# EAGLE design PowerKitPTH (EAGLE 6.6.0)
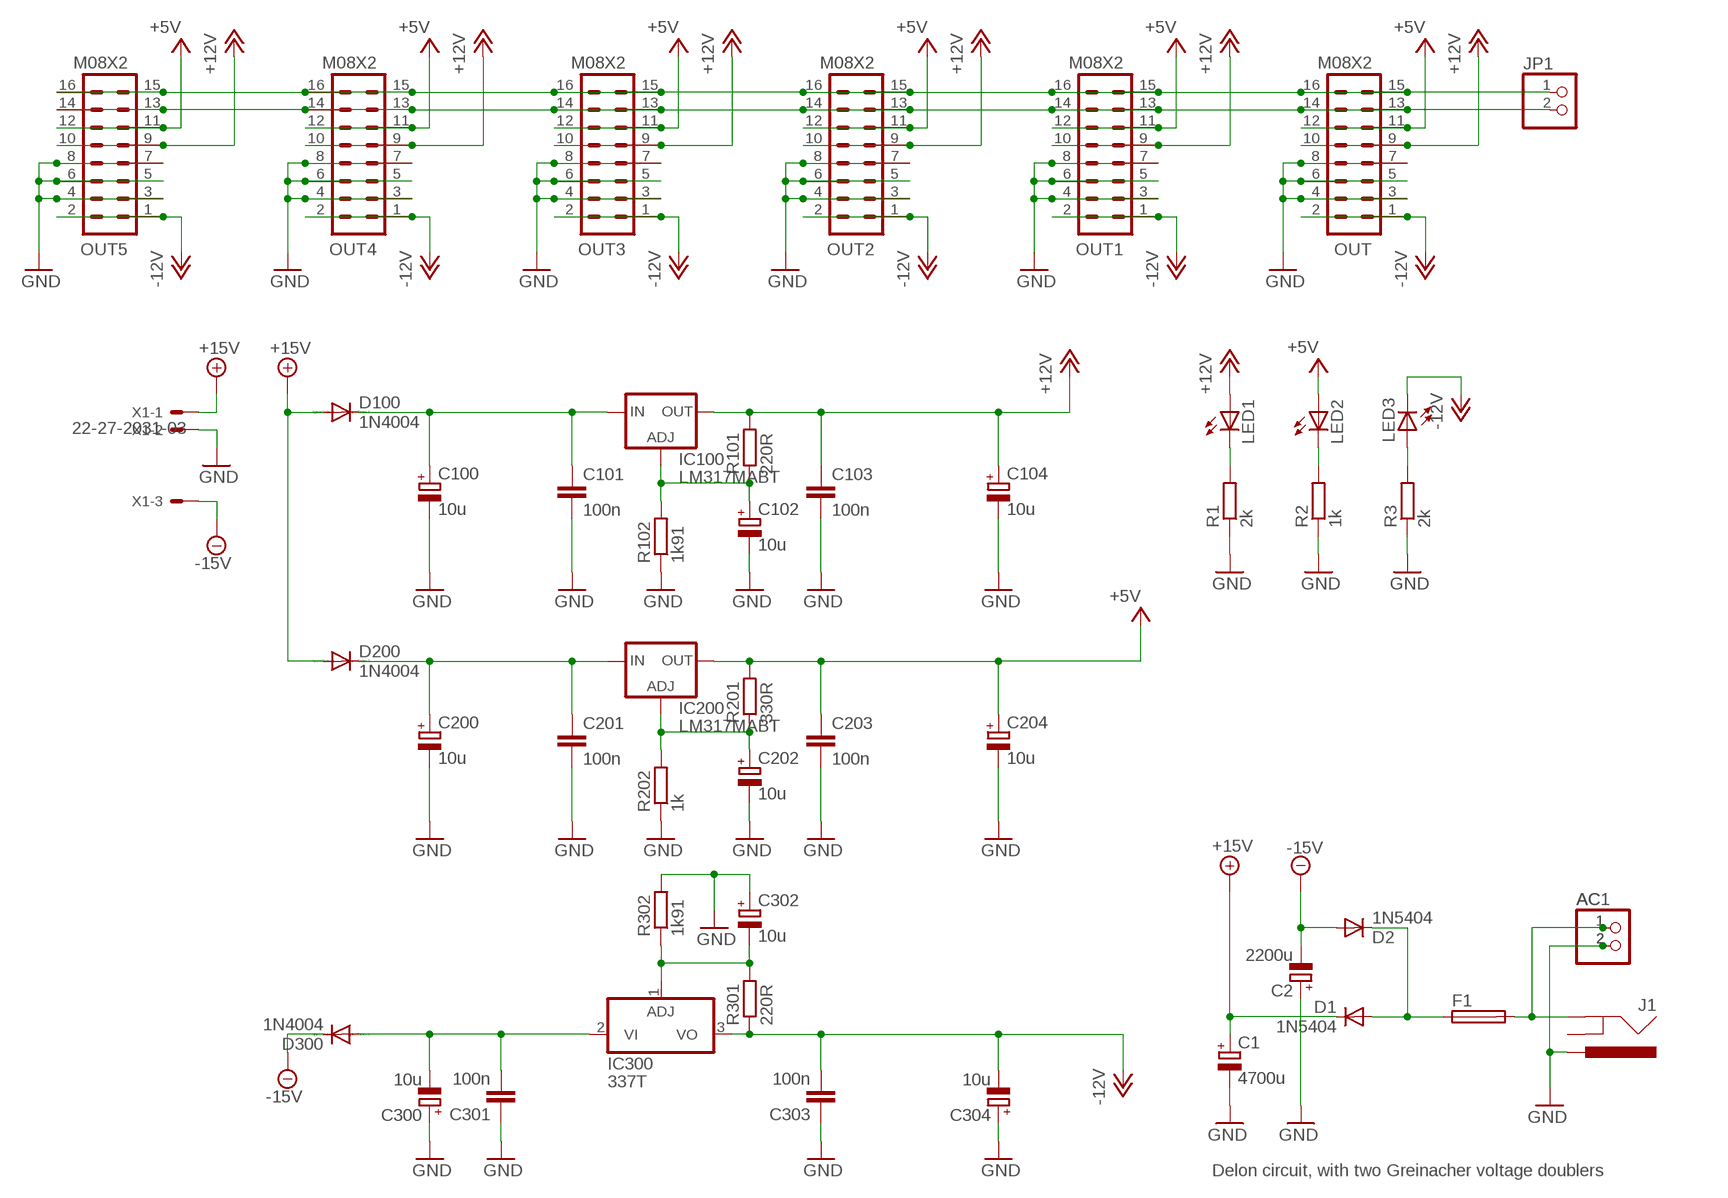
[diagram p0: schematic, sheet 1]

## Parts
AC  PINHD-1X2  [1X02]
AC1  PINHD-1X2  [1X02]
C1  4700u  CPOL-EUE7.5-18  [E7,5-18]
C2  2200u  CPOL-EUE7.5-18  [E7,5-18]
C100  10u  CPOL-EUE2.5-6  [E2,5-6]
C101  100n  C-EU050-025X075  [C050-025X075]
C102  10u  CPOL-EUE2.5-6  [E2,5-6]
C103  100n  C-EU050-025X075  [C050-025X075]
C104  10u  CPOL-EUE2.5-6  [E2,5-6]
C200  10u  CPOL-EUE2.5-6  [E2,5-6]
C201  100n  C-EU050-025X075  [C050-025X075]
C202  10u  CPOL-EUE2.5-6  [E2,5-6]
C203  100n  C-EU050-025X075  [C050-025X075]
C204  10u  CPOL-EUE2.5-6  [E2,5-6]
C300  10u  CPOL-EUE2.5-6  [E2,5-6]
C301  100n  C-EU050-025X075  [C050-025X075]
C302  10u  CPOL-EUE2.5-6  [E2,5-6]
C303  100n  C-EU050-025X075  [C050-025X075]
C304  10u  CPOL-EUE2.5-6  [E2,5-6]
D1  1N5404  DIODE1N4001  [DIODE-1N4001]
D2  1N5404  DIODE1N4001  [DIODE-1N4001]
D100  1N4004  [DO41-10]
D200  1N4004  [DO41-10]
D300  1N4004  [DO41-10]
F1  SH22,5  [SH22,5]
IC100  LM317MABT  [TO220L1]
IC200  LM317MABT  [TO220L1]
IC300  337T  [TO220H]
J1  POWER_JACKPTH  [POWER_JACK_PTH]
JP1  PINHD-1X2  [1X02]
LED1  LED3MM  [LED3MM]
LED2  LED3MM  [LED3MM]
LED3  LED3MM  [LED3MM]
OUT  M08X2  [2X8]
OUT1  M08X2  [2X8]
OUT2  M08X2  [2X8]
OUT3  M08X2  [2X8]
OUT4  M08X2  [2X8]
OUT5  M08X2  [2X8]
R1  2k  R-EU_0204/7  [0204/7]
R2  1k  R-EU_0204/7  [0204/7]
R3  2k  R-EU_0204/7  [0204/7]
R101  220R  R-EU_0204/7  [0204/7]
R102  1k91  R-EU_0204/7  [0204/7]
R201  330R  R-EU_0204/7  [0204/7]
R202  1k  R-EU_0204/7  [0204/7]
R301  220R  R-EU_0204/7  [0204/7]
R302  1k91  R-EU_0204/7  [0204/7]
X1  22-27-2031-03  [6410-03]

## Nets
+5V: C203.1 C204.+ IC200.2(OUT) LED2.A OUT1.11 OUT1.12 OUT2.11 OUT2.12 OUT3.11 OUT3.12 OUT4.11 OUT4.12 OUT5.11 OUT5.12 OUT.11 OUT.12 R201.2
+12V: C103.1 C104.+ IC100.2(OUT) LED1.A OUT1.9 OUT1.10 OUT2.9 OUT2.10 OUT3.9 OUT3.10 OUT4.9 OUT4.10 OUT5.9 OUT5.10 OUT.9 OUT.10 R101.2
+15V: C1.+ D1.C D100.A D200.A X1.1
-12V: C303.2 C304.- IC300.3(VO) LED3.K(C) OUT1.1 OUT1.2 OUT2.1 OUT2.2 OUT3.1 OUT3.2 OUT4.1 OUT4.2 OUT5.1 OUT5.2 OUT.1 OUT.2 R301.1
-15V: C2.- D2.A D300.C X1.3
GND: AC1.2 AC.2 C1.- C2.+ C100.- C101.2 C102.- C103.2 C104.- C200.- C201.2 C202.- C203.2 C204.- C300.+ C301.1 C302.+ C303.1 C304.+ J1.PWR OUT1.3 OUT1.4 OUT1.5 OUT1.6 OUT1.7 OUT1.8 OUT2.3 OUT2.4 OUT2.5 OUT2.6 OUT2.7 OUT2.8 OUT3.3 OUT3.4 OUT3.5 OUT3.6 OUT3.7 OUT3.8 OUT4.3 OUT4.4 OUT4.5 OUT4.6 OUT4.7 OUT4.8 OUT5.3 OUT5.4 OUT5.5 OUT5.6 OUT5.7 OUT5.8 OUT.3 OUT.4 OUT.5 OUT.6 OUT.7 OUT.8 R1.1 R2.1 R3.1 R102.1 R202.1 R302.2 X1.2
N$1: LED2.K(C) R2.2
N$2: LED1.K(C) R1.2
N$3: C102.+ IC100.1(ADJ) R101.1 R102.2
N$4: C202.+ IC200.1(ADJ) R201.1 R202.2
N$5: C302.- IC300.1(ADJ) R301.2 R302.1
N$6: C300.- C301.2 D300.A IC300.2(VI)
N$7: C200.+ C201.1 D200.C IC200.3(IN)
N$8: C100.+ C101.1 D100.C IC100.3(IN)
N$9: LED3.A R3.2
N$10: JP1.2 OUT1.13 OUT1.14 OUT2.13 OUT2.14 OUT3.13 OUT3.14 OUT4.13 OUT4.14 OUT5.13 OUT5.14 OUT.13 OUT.14
N$11: D1.A D2.C F1.1
N$12: JP1.1 OUT1.15 OUT1.16 OUT2.15 OUT2.16 OUT3.15 OUT3.16 OUT4.15 OUT4.16 OUT5.15 OUT5.16 OUT.15 OUT.16
N$13: AC1.1 AC.1 F1.2 J1.GND
Unconnected: J1.GNDBREAK

## Notes on the sheet
- Delon circuit, with two Greinacher voltage doublers

## Library data of the parts
AC AC1 JP1 = pinhead:PINHD-1X2: PIN HEADER
C1 C2 = resistor:CPOL-EU: POLARIZED CAPACITOR, European symbol
C100 C102 C104 C200 C202 C204 C300 C302 C304 = rcl:CPOL-EU: POLARIZED CAPACITOR, European symbol
C101 C103 C201 C203 C301 C303 = resistor:C-EU: CAPACITOR, European symbol
D1 D2 = Rebel:DIODE: Diode These are standard reverse protection diodes and small signal diodes. SMA package can handle up to about 1A. SOD-323 can handle about 200mA. Watch the SOD-323 package when ordering, there are some mfgs out there that are 5-pin packages.
D100 D200 D300 = diode:1N4004: DIODE general purpose rectifier, 1 A
F1 = fuse:SH22,5: FUSE HOLDER grid 22,5 mm, OGN0031 8201, Schurter (Buerklin); MF: SCHURTER; MPN: 0031.8201; OC_FARNELL: 1162740; OC_NEWARK: 96F8317
IC100 IC200 = v-reg:LM317?*: 500 mA Adjustable Output Positive Voltage Regulator Source: http://www.onsemi.co.jp .. LM317M-D.PDF
IC300 = linear:*337: Negative VOLTAGE REGULATOR
J1 = SparkFun:POWER_JACK: Power Jack This is the standard 5.5mm barrel jack for power. The PTH is the most common, proven, reliable, footprint. All others are experimental. The Slot footprint only works if the mill layer is transmitted to the PCB fab house so be warned. Spark Fun Electronics SKU : PRT-00119. Mating wall wart : TOL-00298 (and others)
LED1-LED3 = Rebel:LED: LED
OUT OUT1-OUT5 = SparkFun:M08X2
R1-R3 R101 R102 R201 R202 R301 R302 = resistor:R-EU_: RESISTOR, European symbol
X1 = con-molex:22-?-03: CONNECTOR wire to board 2.54 mm (.1 inch) pitch header; OC_FARNELL: unknown; OC_NEWARK: unknown

## Board
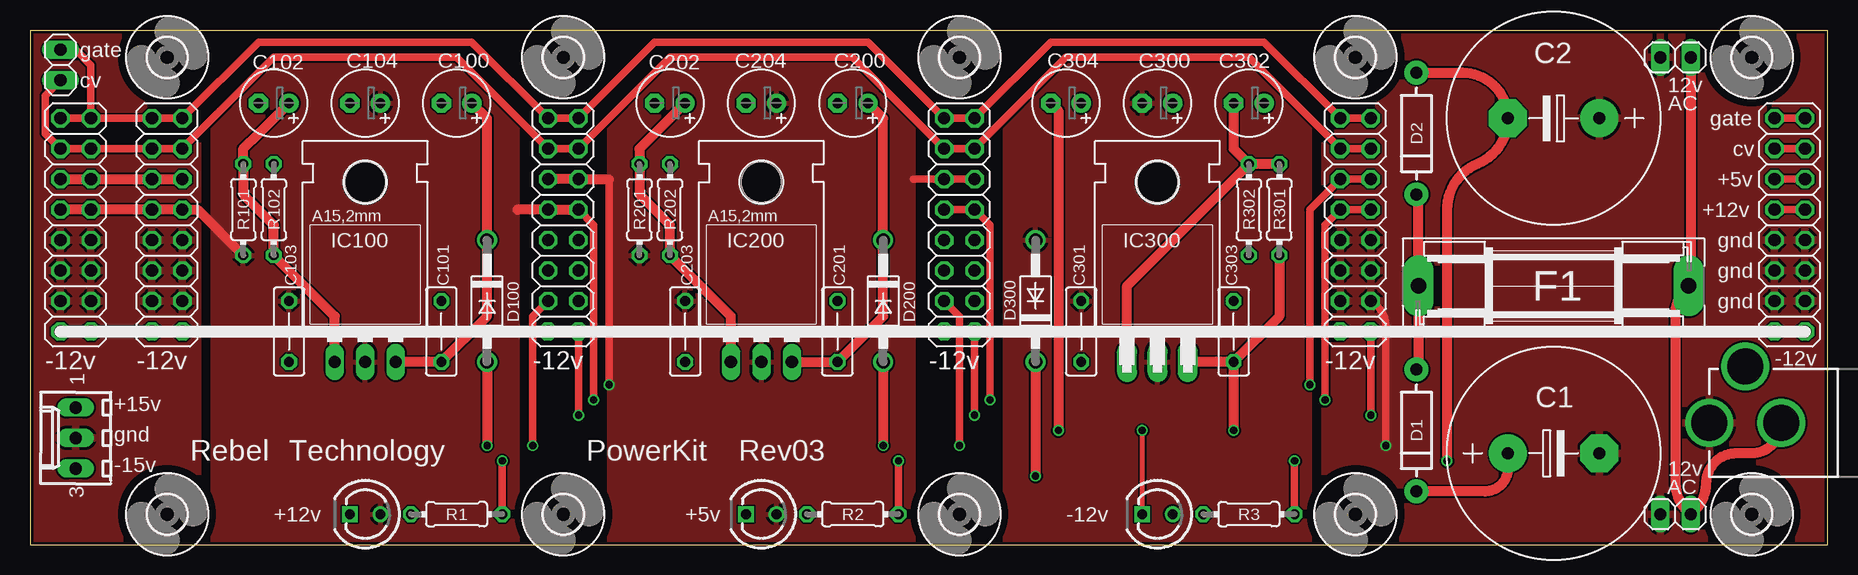
[diagram p1: board, top side]
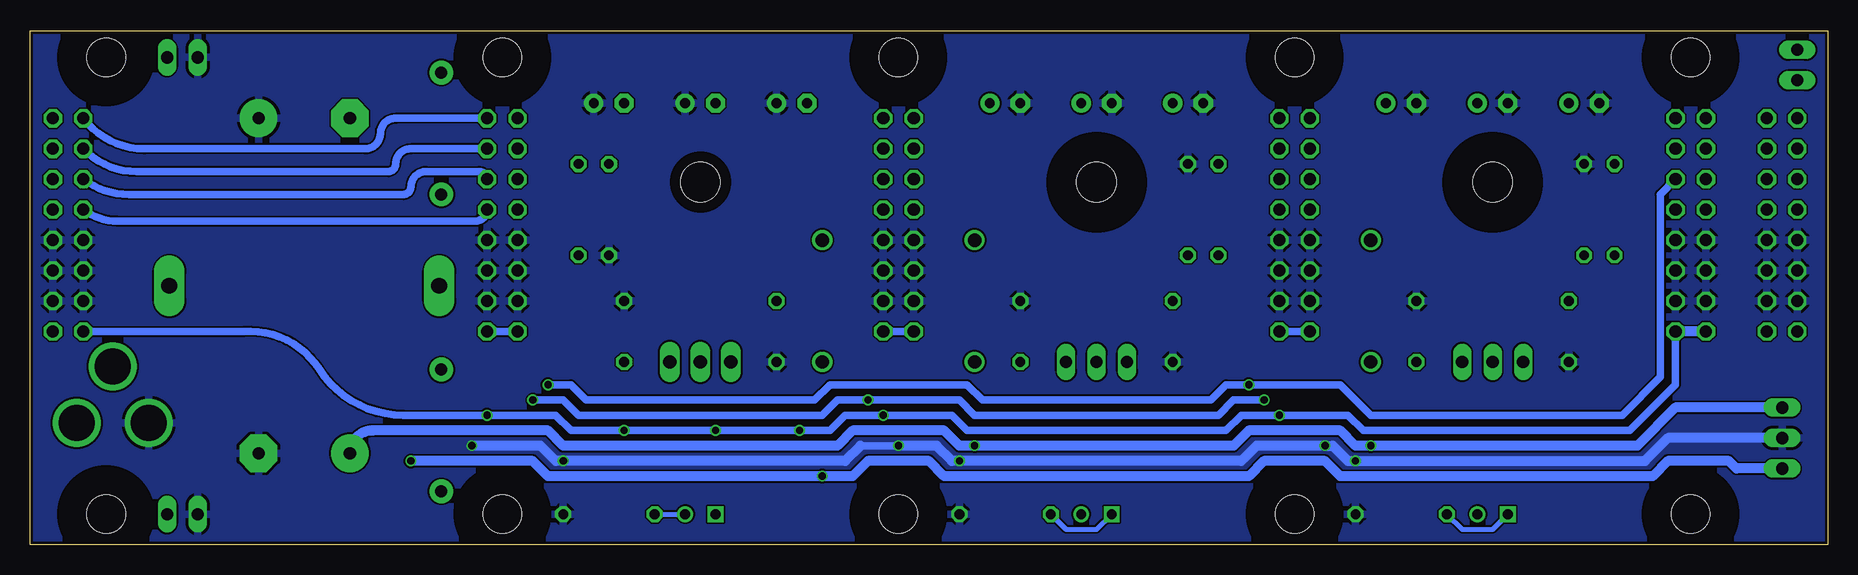
[diagram p2: board, bottom side, seen from below]

Size 149.86 x 42.85 mm. Coordinates in mm from the lower left corner, seen from the top.
Outline: 0,0 149.86,0 149.86,42.85 0,42.85 0,0
Copper layers (1*16): Top 0.035mm / dielectric 1.5mm / Bottom 0.035mm
Design rules "Fusion_eagle_rule_v1.1": minimum track width 6mil, minimum drill 12mil, track to track 6mil, track to pad 6mil, pad to pad 6mil, via to via 6mil, smd to smd 0mil, copper to edge 10mil, drill to drill 10mil, minimum pad ring 10mil, minimum via ring 6mil, stop-mask expansion 2mil, vias tented up to drill 100mil, thermal gap 10mil

### Footprints (pad centres in the part's own frame; a part is rotated, then mirrored left to right if it is on the bottom)
1X02 = drill 1.016 long: 1 -1.27,0; 2 1.27,0
E7,5-18 = drill 1.016 pad 3.15: + -3.81,0 | drill 1.016 pad 3.15 octagon: - 3.81,0
E2,5-6 = drill 0.813 pad 1.6: + -1.27,0 | drill 0.813 pad 1.6 octagon: - 1.27,0
C050-025X075 = drill 0.813 octagon: 1 -2.54,0; 2 2.54,0
DIODE-1N4001 = drill 1 pad 1.981: A -5.08,0; C 5.08,0
DO41-10 = drill 1.118: A 5.08,0; C -5.08,0
SH22,5 = drill 1.321 pad 2.54 long: 1 -11.252,0; 2 11.252,0
TO220L1 = drill 1.016 long: 1 -2.54,-3.81; 2 0,-3.81; 3 2.54,-3.81 | hole 3.302: 0,11.176
TO220H = drill 1.118 long: 1 -2.54,-10.16; 2 0,-10.16; 3 2.54,-10.16 | hole 3.302: 0,4.826
POWER_JACK_PTH = drill 2.997: GND 0,7.7; GNDBREAK 4.7,10.7; PWR 0,13.7
LED3MM = drill 0.813: A -1.27,0 | drill 0.813 square: K 1.27,0
2X8 = drill 1.016 octagon: 1 0,0; 2 0,2.54; 3 2.54,0; 4 2.54,2.54; 5 5.08,0; 6 5.08,2.54; 7 7.62,0; 8 7.62,2.54; 9 10.16,0; 10 10.16,2.54; 11 12.7,0; 12 12.7,2.54; 13 15.24,0; 14 15.24,2.54; 15 17.78,0; 16 17.78,2.54
0204/7 = drill 0.813 octagon: 1 -3.81,0; 2 3.81,0
3,2 = hole 3.2: 0,0
6410-03 = drill 1.016 long: 1 2.54,0; 2 0,0; 3 -2.54,0

### Placement (x,y rotation side)
AC  137.16,2.54 180 top
AC1  137.16,40.64 180 top
C1  127,7.62 0 top
C2  127,35.56 180 top
C100  35.56,36.83 180 top
C101  34.29,17.78 90 top
C102  20.32,36.83 180 top
C103  21.59,17.78 270 top
C104  27.94,36.83 180 top
C200  68.58,36.83 180 top
C201  67.31,17.78 90 top
C202  53.34,36.83 180 top
C203  54.61,17.78 270 top
C204  60.96,36.83 180 top
C300  93.98,36.83 180 top
C301  87.63,17.78 90 top
C302  101.6,36.83 180 top
C303  100.33,17.78 270 top
C304  86.36,36.83 180 top
D1  115.57,9.53 270 top
D2  115.57,34.29 270 top
D100  38.1,20.32 270 top
D200  71.12,20.32 270 top
D300  83.82,20.32 90 top
F1  127,21.59 0 top
IC100  27.94,19.05 0 top
IC200  60.96,19.05 0 top
IC300  93.98,25.4 0 top
J1  153.67,10.16 90 top
JP1  2.54,40.01 270 top
LED1  27.94,2.54 180 top
LED2  60.96,2.54 180 top
LED3  93.98,2.54 180 top
OUT  12.7,17.78 90 top
OUT1  45.72,17.78 90 top
OUT2  78.74,17.78 90 top
OUT3  111.76,17.78 90 top
OUT4  147.96,17.78 90 top
OUT5  5.08,17.78 90 top
R1  35.56,2.54 180 top
R2  68.58,2.54 180 top
R3  101.6,2.54 180 top
R101  17.78,27.94 270 top
R102  20.32,27.94 270 top
R201  50.8,27.94 270 top
R202  53.34,27.94 270 top
R301  104.14,27.94 90 top
R302  101.6,27.94 270 top
U$1  [3,2]  44.45,2.54 0 top
U$2  [3,2]  110.49,2.54 0 top
U$3  [3,2]  44.45,40.64 0 top
U$4  [3,2]  110.49,40.64 0 top
U$5  [3,2]  11.43,40.64 0 top
U$6  [3,2]  11.43,2.54 0 top
U$7  [3,2]  77.47,40.64 0 top
U$8  [3,2]  77.47,2.54 0 top
U$12  [3,2]  143.51,40.64 0 top
U$13  [3,2]  143.51,2.54 0 top
X1  3.81,8.89 90 top

### Tracks (layer width: path | path; a pad name or v marks a point on that pad's centre or on a via)
+5V  (via drill 0.6)
  Top 0.61: 48.26,30.48 v48.26,13.34 | 73.66,30.48 OUT2.12 OUT2.11 | OUT4.11 OUT4.12 | v106.68,13.34 106.68,27.94 OUT3.12 OUT3.11
  Top 0.813: 48.26,30.48 OUT1.11 OUT1.12 | OUT5.12 OUT5.11 OUT.12 OUT.11
  Bottom 0.61: OUT.11 13.97,29.21 13.97,13.97 17.14,10.79 38.1,10.79 40.64,13.34 v48.26,13.34 50.16,13.34 51.44,12.06 70.48,12.06 71.75,13.34 83.19,13.34 84.45,12.06 103.5,12.06 104.78,13.34 v106.68,13.34 | OUT3.11 arc-90 112.39,31.11 116.84,31.11 arc-90 118.11,29.84 arc90 118.75,29.21 141.6,29.21 arc37 OUT4.12
  pour Top: 48.26,44.45 48.26,0 73.66,0 73.66,44.45
+12V  (via drill 0.6)
  Top 0.61: OUT1.9 46.99,26.67 v46.99,12.06 | v80.01,12.06 80.01,26.67 OUT2.9 OUT2.10 | v107.95,12.06 107.95,26.67 OUT3.10 OUT3.9 | OUT4.9 OUT4.10
  Top 0.813: 40.64,27.94 OUT1.10 OUT1.9 | OUT5.10 OUT5.9 OUT.10 OUT.9 13.97,27.94 R101.2
  Bottom 0.61: v46.99,12.06 49.53,12.06 50.8,10.79 71.12,10.79 72.39,12.06 v80.01,12.06 82.55,12.06 83.82,10.79 104.14,10.79 105.41,12.06 v107.95,12.06 | OUT4.10 arc-37 142.56,26.99 112.71,26.99 arc-90 OUT3.9
  pour Top: 15.24,44.45 15.24,0 40.64,0 40.64,44.45
+15V  (via drill 0.6)
  Top 0.813: D100.A v38.1,8.26 | D200.A v71.12,8.26 | C1.+ 123.19,6.35 arc-90 121.28,4.45 D1.C
  Bottom 0.813: X1.1 12.7,11.43 15.88,8.26 v38.1,8.26 39.37,8.26 40.64,9.53 48.26,9.53 49.53,8.26 v71.12,8.26 72.39,8.26 73.66,9.53 81.28,9.53 82.55,8.26 105.41,8.26 106.68,9.53 121.28,9.53 arc-90 C1.+
-12V  (via drill 0.6)
  Top 0.406: LED3.K v92.71,9.53
  Top 0.61: OUT1.1 v45.72,10.79 | OUT2.1 v78.74,10.79 | OUT3.1 v111.76,10.79 | OUT4.1 OUT4.2
  Top 0.813: OUT.2 OUT5.1 OUT5.2 | C303.2 v100.33,9.53 | C303.2 IC300.3 | R301.1 104.14,19.05 C303.2 | C304.- 85.72,36.2 v85.72,9.53
  Bottom 0.61: OUT.1 12.7,13.34 16.51,9.53 38.73,9.53 40.01,10.79 v45.72,10.79 48.9,10.79 50.16,9.53 71.75,9.53 73.03,10.79 v78.74,10.79 81.92,10.79 83.19,9.53 v85.72,9.53 v92.71,9.53 v100.33,9.53 104.78,9.53 106.05,10.79 v111.76,10.79 118.75,10.79 arc57 125.73,14.61 arc-61 132.08,17.78 OUT4.2 | OUT2.1 OUT2.2 | OUT1.1 OUT1.2 | OUT3.1 OUT3.2
  Bottom 0.813: OUT.2 OUT.1
-15V  (via drill 0.6)
  Top 0.813: D300.C v83.82,5.71 | D2.A 119.38,39.37 arc-90 C2.- arc-67 120.65,31.75 arc67 118.11,27.94 v118.11,6.99
  Bottom 0.813: X1.3 7.62,6.35 8.26,6.99 13.34,6.99 14.61,5.71 40.64,5.71 41.91,6.99 46.99,6.99 48.26,5.71 73.66,5.71 74.93,6.99 80.01,6.99 81.28,5.71 v83.82,5.71 106.68,5.71 107.95,6.99 v118.11,6.99
GND  (via drill 0.6)
  Top 0.61: OUT2.4 77.47,19.05 v77.47,8.26 | OUT1.4 41.91,19.05 v41.91,8.26 | v113.03,8.26 113.03,18.41 arc53 OUT3.3 | R1.1 v39.37,6.99 | R2.1 v72.39,6.99 | R3.1 v105.41,6.99
  Bottom 0.61: v77.47,8.26 80.64,8.26
  Bottom 0.813: X1.2 13.34,8.89 15.24,6.99 v39.37,6.99 40.01,6.99 41.27,8.26 v41.91,8.26 47.62,8.26 48.9,6.99 v72.39,6.99 73.03,6.99 74.3,8.26 v77.47,8.26 | 80.64,8.26 81.92,6.99 v105.41,6.99 106.05,6.99 107.31,8.26 v113.03,8.26
  pour Bottom: 0,10.79 0,0 114.3,0 114.3,10.79
  pour Bottom: 0,44.45 0,0 13.97,0 13.97,44.45
  pour Bottom: 13.97,44.45 13.97,0 151.13,0 151.13,44.45
  pour Bottom: 74.93,26.67 80.01,26.67 80.01,19.05 74.93,19.05
  pour Bottom: 41.91,26.67 46.99,26.67 46.99,19.05 41.91,19.05
  pour Top: 107.95,44.45 107.95,0 151.13,0 151.13,44.45
  pour Top: 0,44.45 0,0 13.97,0 13.97,44.45
N$1
  Bottom 0.406: R2.2 63.5,1.27 60.96,1.27 LED2.K
N$2
  Bottom 0.406: R1.2 30.48,1.27 27.94,1.27 LED1.K
N$3
  Top 0.813: IC100.1 25.4,19.05 R102.2 20.32,26.67 17.78,29.21 R101.1 17.78,33.02 19.05,34.29 C102.+
N$4
  Top 0.813: IC200.1 58.42,19.05 R202.2 53.34,26.67 50.8,29.21 R201.1 50.8,33.02 52.07,34.29 C202.+
N$5
  Top 0.813: IC300.1 91.44,21.59 R302.1 | R301.2 R302.1 | C302.- 100.33,33.02 R302.1
N$6
  pour Top: 81.28,44.45 81.28,0 106.68,0 106.68,44.45
N$7
  Top 0.813: IC200.3 C201.1 71.12,19.05 D200.C 71.12,35.56 C200.+
N$8
  Top 0.813: IC100.3 C101.1 38.1,19.05 D100.C 38.1,35.56 C100.+
N$9
  Bottom 0.406: R3.2 LED3.A
N$10
  Top 0.61: OUT3.13 OUT3.14 101.6,40.64 86.36,40.64 OUT2.13 OUT2.14 68.58,40.64 53.34,40.64 OUT1.13 OUT1.14 35.56,40.64 20.32,40.64 OUT.13 OUT.14 OUT5.13 OUT5.14 1.27,34.29 1.27,37.47 JP1.2 | OUT4.13 OUT4.14
  Bottom 0.61: OUT3.13 118.11,33.02 arc-90 119.38,31.75 arc90 120.02,31.11 140.97,31.11 arc46 OUT4.14
N$11
  Top 0.813: D2.C 115.75,29.03 F1.1 115.75,15.42 D1.A
N$12
  Top 0.61: OUT5.16 OUT5.15 | OUT5.15 OUT.16 OUT.15 19.05,41.91 36.83,41.91 OUT1.16 OUT1.15 52.07,41.91 69.85,41.91 OUT2.16 OUT2.15 85.09,41.91 102.87,41.91 OUT3.16 OUT3.15 | OUT4.15 OUT4.16 | JP1.1 3.81,41.27 5.08,40.01 OUT5.15
  Bottom 0.61: OUT3.15 119.38,35.56 arc-90 120.65,34.29 arc90 121.92,33.02 140.34,33.02 arc53 OUT4.16
N$13
  Top 0.813: AC.1 138.43,2.62 | AC1.1 138.43,21.77 F1.2 arc50 137.16,19.23 137.16,5.08 arc53 AC.1 | J1.GND 145.97,10.08 arc-90 143.51,7.62 142.24,7.62 arc90 139.7,5.08 arc-53 AC.1

### Text on the board
tPlace: gate | cv | 12v | AC | gate | cv | +5v | +12v | gnd | gnd | gnd | -12v | -12v | -12v | -12v | -12v | -12v | +15v | gnd | Rebel | Technology | PowerKit | Rev03 | -15v | 12v | +12v | +5v | -12v